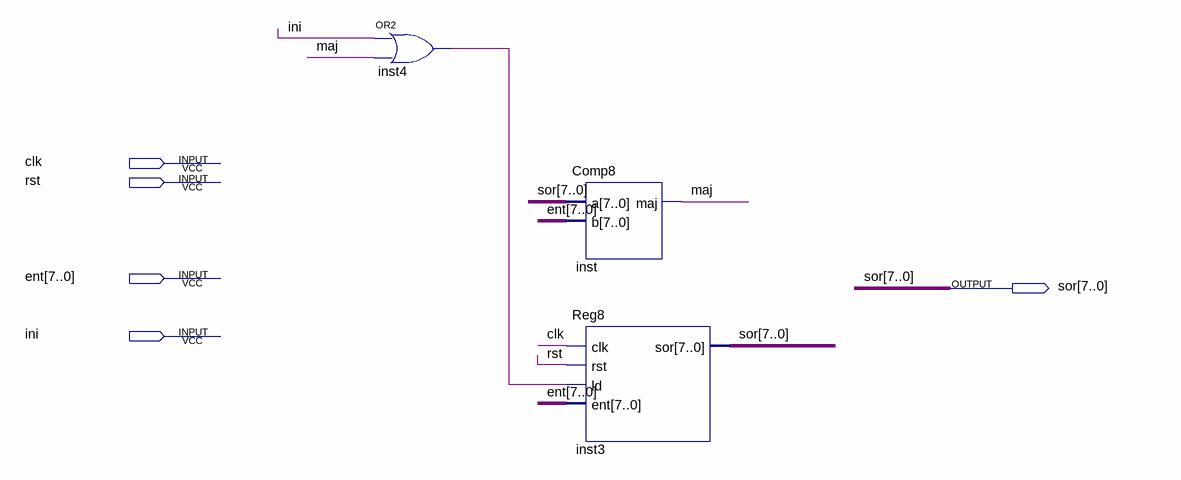
[diagram p0: schematic sheet]
// Quartus schematic min.bdf as structural Verilog: 3 symbols, 5 pins
module min (
  input  clk,
  input  rst,
  input  [7:0] ent,
  input  ini,
  output [7:0] sor
);

  wire inst4_out, maj;

  or inst4 (inst4_out, ini, maj);
  Comp8 inst (.a(sor), .b(ent), .maj(maj));
  Reg8 inst3 (.clk(clk), .rst(rst), .ld(inst4_out), .ent(ent), .sor(sor));
endmodule
